# EAGLE design learn_smd (EAGLE 7.6.0)
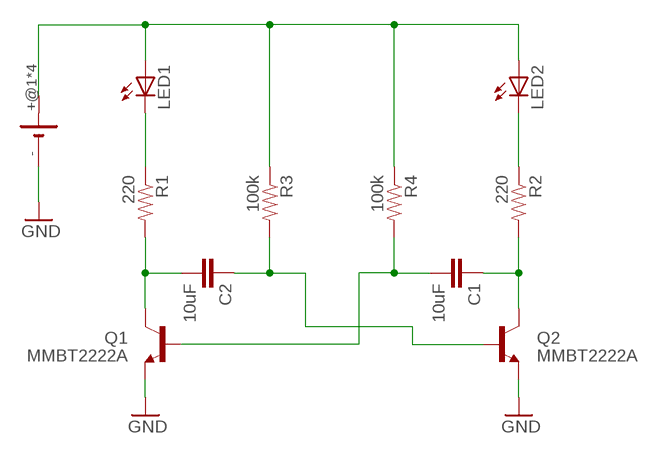
[diagram p0: schematic, sheet 1]

## Parts
BT1  BAT-HLD-001-THM  [LINX_BAT-HLD-001-THM]
C1  10uF  CAP0805  [0805]
C2  10uF  CAP0805  [0805]
LED1  LEDCHIP-LED0805  [CHIP-LED0805]
LED2  LEDCHIP-LED0805  [CHIP-LED0805]
Q1  MMBT2222A  TRANSISTOR_NPNMMBT2222A  [SOT23-3]
Q2  MMBT2222A  TRANSISTOR_NPNMMBT2222A  [SOT23-3]
R1  220  RESISTOR0805-RES  [0805]
R2  220  RESISTOR0805-RES  [0805]
R3  100k  RESISTOR0805-RES  [0805]
R4  100k  RESISTOR0805-RES  [0805]

## Nets
GND: BT1.- Q1.2(E) Q2.2(E)
N$1: LED1.C R1.1
N$2: C2.2 Q1.3(C) R1.2
N$3: C1.2 Q1.1(B) R4.2
N$4: C1.1 Q2.3(C) R2.2
N$5: LED2.C R2.1
N$6: BT1.+@1(+) BT1.+@2(+) BT1.+@3(+) BT1.+@4(+) LED1.A LED2.A R3.1 R4.1
N$7: C2.1 Q2.1(B) R3.2

## Library data of the parts
BT1 = BAT-HLD-001-THM:BAT-HLD-001-THM: Battery Holder CR2025/2032 Through Hole Mount; COST1000: 0.196; COST1000_B: 0.184; LINK: http://www.mouser.com/ProductDetail/Linx-Technologies/BAT-HLD-001-THM/; LINK_B: http://www.mouser.com/ProductDetail/Panasonic-Battery/CR2016/
C1 C2 = SparkFun-Capacitors:CAP: Capacitor Standard 0603 ceramic capacitor, and 0.1" leaded capacitor.
LED1 LED2 = led:LED: LED OSRAM: - CHIPLED LG R971, LG N971, LY N971, LG Q971, LY Q971, LO R971, LY R971 LH N974, LH R974 LS Q976, LO Q976, LY Q976 LO Q996 - Hyper CHIPLED LW Q18S LB Q993, LB Q99A, LB R99A - SideLED LS A670, LO A670, LY A670, LG A670, LP A670 LB A673, LV A673, LT A673, LW A673 LH A674 LY A675 LS A676, LA A676, LO A676, LY A676, LW A676 LS A679, LY A679, LG A679 - Hyper Micro SIDELED® LS Y876, LA Y876, LO Y876, LY Y876 LT Y87S - SmartLED LW L88C, LW L88S LB L89C, LB L89S, LG L890 LS L89K, LO L89K, LY L89K LS L896, LA L896, LO L896, LY L896 - TOPLED LS T670, LO T670, LY T670, LG T670, LP T670 LSG T670, LSP T670, LSY T670, LOP T670, LYG T670 LG T671, LOG T671, LSG T671 LB T673, LV T673, LT T673, LW T673 LH T674 LS T676, LA T676, LO T676, LY T676, LB T676, LH T676, LSB T676, LW T676 LB T67C, LV T67C, LT T67C, LS T67K, LO T67K, LY T67K, LW E67C LS E67B, LA E67B, LO E67B, LY E67B, LB E67C, LV E67C, LT E67C LW T67C LS T679, LY T679, LG T679 LS T770, LO T770, LY T770, LG T770, LP T770 LB T773, LV T773, LT T773, LW T773 LH T774 LS E675, LA E675, LY E675, LS T675 LS T776, LA T776, LO T776, LY T776, LB T776 LHGB T686 LT T68C, LB T68C - Hyper Mini TOPLED® LB M676 - Mini TOPLED Santana® LG M470 LS M47K, LO M47K, LY M47K Source: http://www.osram.convergy.de LUXEON: - LUMILED® LXK2-PW12-R00, LXK2-PW12-S00, LXK2-PW14-U00, LXK2-PW14-V00 LXK2-PM12-R00, LXK2-PM12-S00, LXK2-PM14-U00 LXK2-PE12-Q00, LXK2-PE12-R00, LXK2-PE12-S00, LXK2-PE14-T00, LXK2-PE14-U00 LXK2-PB12-K00, LXK2-PB12-L00, LXK2-PB12-M00, LXK2-PB14-N00, LXK2-PB14-P00, LXK2-PB14-Q00 LXK2-PR12-L00, LXK2-PR12-M00, LXK2-PR14-Q00, LXK2-PR14-R00 LXK2-PD12-Q00, LXK2-PD12-R00, LXK2-PD12-S00 LXK2-PH12-R00, LXK2-PH12-S00 LXK2-PL12-P00, LXK2-PL12-Q00, LXK2-PL12-R00 Source: www.luxeon.com KINGBRIGHT: KA-3528ASYC Source: www.kingbright.com
Q1 Q2 = SparkFun-DiscreteSemi:TRANSISTOR_NPN: Generic NPN BJT MMBT2222A - TRANS-08049 (SOT-23, 1A 40V) MPSA42 - TRANS-09116 (SOT-23, 500mA 300V) MMBT5088LT1G - TRANS-11160 (SOT-23, 50 mA 30V) BC547 - COM-08928 <http://www.sparkfun.com/products/8928> (TO-92 45V 100mA) (1.Collector 2.Base 3.Emitter) 2N3904 - COM-00521 <http://www.sparkfun.com/products/521> (TO-92 40V 200mA) (1.Emitter 2.Base 3.Collector) P2N2222A - COM-12852 <http://www.sparkfun.com/products/12852> (TO-92 40V 600mA) (1.Collector 2.Base 3.Emitter); PROD_ID: TRANS-08049
R1-R4 = SparkFun-Passives:RESISTOR: Resistor Basic schematic elements and footprints for 0603, 1206, and PTH resistors.

## Board
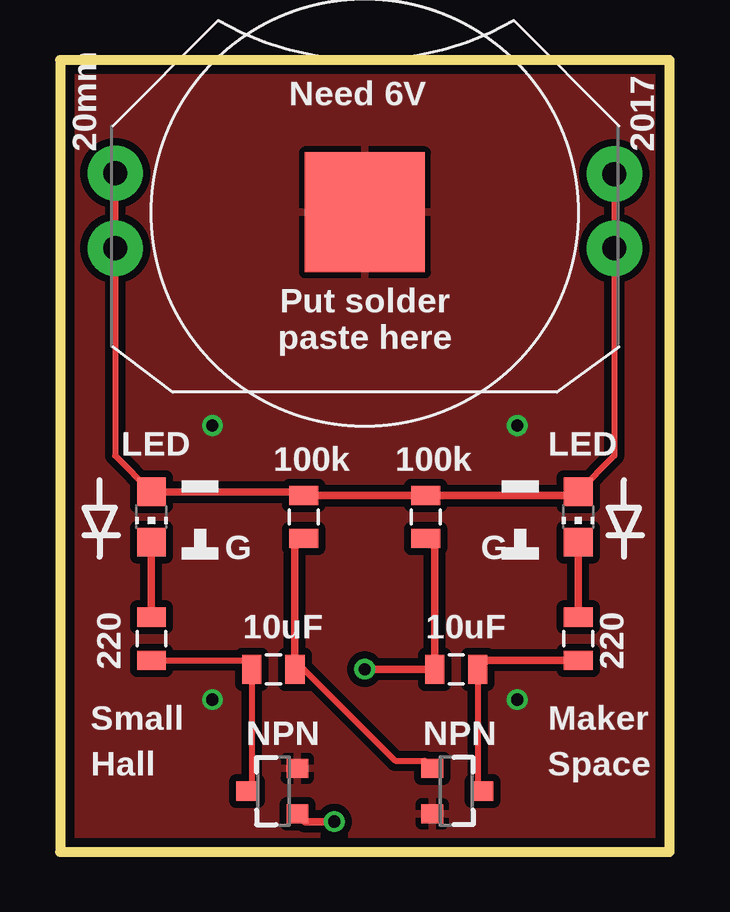
[diagram p1: board, top side]
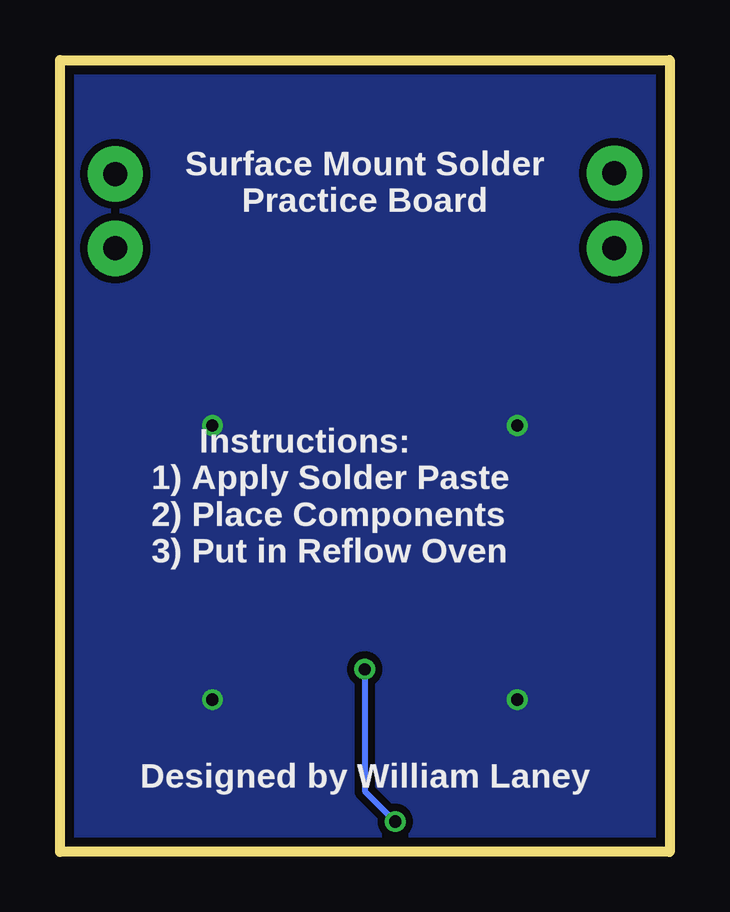
[diagram p2: board, bottom side, seen from below]

Size 25.4 x 33.02 mm. Coordinates in mm from the lower left corner, seen from the top.
Outline: 0,0 25.4,0 25.4,33.02 0,33.02 0,0
Copper layers (1*16): Top 0.0356mm / dielectric 1.5011mm / Bottom 0.0356mm
Design rules "oshpark-2layer": minimum track width 6mil, minimum drill 13mil, track to track 6mil, track to pad 6mil, pad to pad 6mil, via to via 6mil, smd to smd 6mil, copper to edge 15mil, drill to drill 6mil, minimum pad ring 7mil, minimum via ring 7mil, stop-mask expansion 2.5mil, vias tented up to drill 0mil, thermal gap 10mil

### Footprints (pad centres in the part's own frame; a part is rotated, then mirrored left to right if it is on the bottom)
LINX_BAT-HLD-001-THM = drill 1 pad 2.3: +@1 -10.4,1.5; +@2 -10.4,-1.6; +@3 10.4,1.5; +@4 10.4,-1.627 | smd 5 x 5: - 0,0
0805 = smd 0.8 x 1.2: 1 -0.9,0; 2 0.9,0
CHIP-LED0805 = smd 1.2 x 1.2: A 0,-1.05; C 0,1.05
SOT23-3 = smd 0.8 x 0.9: 1 -0.95,-1; 2 0.95,-1; 3 0,1.1

### Placement (x,y rotation side)
BT1  12.7,26.67 180 top
C1  16.51,7.62 180 top
C2  8.89,7.62 180 top
LED1  3.81,13.97 180 top
LED2  21.59,13.97 180 top
Q1  8.89,2.54 90 top
Q2  16.51,2.54 270 top
R1  3.81,8.89 270 top
R2  21.59,8.89 270 top
R3  10.16,13.97 270 top
R4  15.24,13.97 270 top

### Tracks (layer width: path | path; a pad name or v marks a point on that pad's centre or on a via)
GND  (via drill 0.51)
  other vias: 6.35,17.78 19.05,17.78 6.35,6.35 19.05,6.35
  pour Top (isolate 0.305): 0,0 0,33.02 25.4,33.02 25.4,0
  pour Bottom (isolate 0.305): 0,33.02 25.4,33.02 25.4,0 0,0
N$1
  Top 0.305: R1.1 LED1.C
N$2
  Top 0.254: R1.2 7.62,7.99 C2.2 7.99,2.74 Q1.3
N$3  (via drill 0.51)
  Top 0.305: R4.2 15.61,12.7 C1.2 v12.7,7.62 | v11.43,1.27 10.21,1.27 Q1.1
  Bottom 0.254: v12.7,7.62 12.7,2.54 v11.43,1.27
N$4
  Top 0.254: C1.1 17.41,2.74 Q2.3
  Top 0.305: R2.2 17.78,7.99 C1.1
N$5
  Top 0.305: R2.1 LED2.C
N$6
  Top 0.254: 3.57,15.26 LED1.A 2.3,16.53 BT1.+@3 BT1.+@4 | 21.83,15.26 LED2.A 23.1,16.53 BT1.+@1 BT1.+@2
  Top 0.305: 21.59,14.87 LED2.A 21.44,14.87 R4.1 R3.1 10.01,15.02 LED1.A
N$7
  Top 0.254: C2.1 10.16,7.62 13.97,3.81 15.19,3.81 Q2.1
  Top 0.305: C2.1 9.79,12.7 R3.2

### Text on the board
tPlace: Need 6V | 20mm | 2017 | Put solder / paste here | LED | LED | 100k | 100k | G | G | 10uF | 10uF | 220 | 220 | Small | Maker | NPN | NPN | Hall | Space
bPlace: Surface Mount Solder / Practice Board | Instructions: / 1) Apply Solder Paste / 2) Place Components / 3) Put in Reflow Oven | Designed by William Laney